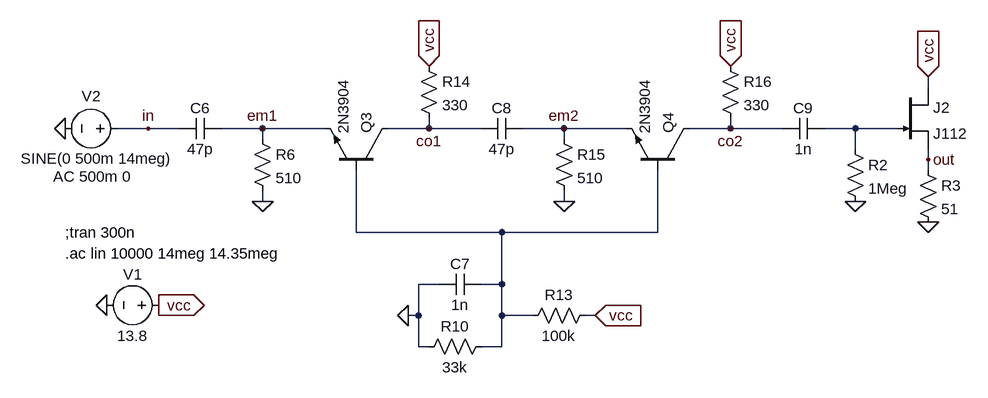
[diagram p0: schematic shifter-simple.asc]
shifter-simple.asc, the LTspice schematic file:
Version 4
SHEET 1 3080 1188
WIRE 2048 736 2048 720
WIRE 848 800 800 800
WIRE 896 800 848 800
WIRE 1024 800 960 800
WIRE 1120 800 1024 800
WIRE 1280 800 1280 784
WIRE 1280 800 1216 800
WIRE 1360 800 1280 800
WIRE 1488 800 1424 800
WIRE 1584 800 1488 800
WIRE 1744 800 1744 784
WIRE 1744 800 1680 800
WIRE 1824 800 1744 800
WIRE 1936 800 1888 800
WIRE 2000 800 1936 800
WIRE 1024 816 1024 800
WIRE 1488 816 1488 800
WIRE 1936 832 1936 800
WIRE 2048 848 2048 832
WIRE 2048 864 2048 848
WIRE 1024 912 1024 896
WIRE 1488 912 1488 896
WIRE 1168 960 1168 864
WIRE 1392 960 1168 960
WIRE 1632 960 1632 864
WIRE 1632 960 1392 960
WIRE 1296 1040 1264 1040
WIRE 1392 1040 1392 960
WIRE 1392 1040 1360 1040
WIRE 1264 1088 1264 1040
WIRE 1264 1088 1248 1088
WIRE 1392 1088 1392 1040
WIRE 1440 1088 1392 1088
WIRE 1536 1088 1520 1088
WIRE 1264 1136 1264 1088
WIRE 1280 1136 1264 1136
WIRE 1392 1136 1392 1088
WIRE 1392 1136 1360 1136
FLAG 864 1072 vcc
IOPIN 864 1072 Out
FLAG 784 1072 0
FLAG 1936 912 0
FLAG 2048 720 vcc
IOPIN 2048 720 In
FLAG 2048 944 0
FLAG 2048 848 out
FLAG 720 800 0
FLAG 848 800 in
FLAG 1024 800 em1
FLAG 1024 912 0
FLAG 1248 1088 0
FLAG 1536 1088 vcc
IOPIN 1536 1088 In
FLAG 1280 704 vcc
IOPIN 1280 704 In
FLAG 1488 800 em2
FLAG 1488 912 0
FLAG 1744 704 vcc
IOPIN 1744 704 In
FLAG 1280 800 co1
FLAG 1744 800 co2
SYMBOL voltage 880 1072 R90
WINDOW 0 -32 56 VBottom 2
WINDOW 3 32 56 VTop 2
WINDOW 123 0 0 Left 0
WINDOW 39 0 0 Left 0
SYMATTR InstName V1
SYMATTR Value 13.8
SYMBOL res 1920 816 R0
SYMATTR InstName R2
SYMATTR Value 1Meg
SYMBOL njf 2000 736 R0
SYMATTR InstName J2
SYMATTR Value J112
SYMBOL res 2032 848 R0
SYMATTR InstName R3
SYMATTR Value 51
SYMBOL voltage 816 800 R90
WINDOW 0 -50 41 VRight 2
WINDOW 3 46 -70 VRight 2
WINDOW 123 74 -7 VRight 2
WINDOW 39 0 0 Left 0
SYMATTR InstName V2
SYMATTR Value SINE(0 500m 14meg)
SYMATTR Value2 AC 500m 0
SYMBOL cap 960 784 R90
WINDOW 0 0 32 VBottom 2
WINDOW 3 32 32 VTop 2
SYMATTR InstName C6
SYMATTR Value 47p
SYMBOL npn 1216 864 M270
SYMATTR InstName Q3
SYMATTR Value 2N3904
SYMBOL res 1008 800 R0
SYMATTR InstName R6
SYMATTR Value 510
SYMBOL res 1376 1120 R90
WINDOW 0 0 56 VBottom 2
WINDOW 3 32 56 VTop 2
SYMATTR InstName R10
SYMATTR Value 33k
SYMBOL cap 1360 1024 R90
WINDOW 0 0 32 VBottom 2
WINDOW 3 32 32 VTop 2
SYMATTR InstName C7
SYMATTR Value 1n
SYMBOL res 1424 1104 R270
WINDOW 0 32 56 VTop 2
WINDOW 3 0 56 VBottom 2
SYMATTR InstName R13
SYMATTR Value 100k
SYMBOL res 1264 688 R0
SYMATTR InstName R14
SYMATTR Value 330
SYMBOL cap 1424 784 R90
WINDOW 0 0 32 VBottom 2
WINDOW 3 32 32 VTop 2
SYMATTR InstName C8
SYMATTR Value 47p
SYMBOL npn 1680 864 M270
SYMATTR InstName Q4
SYMATTR Value 2N3904
SYMBOL res 1472 800 R0
SYMATTR InstName R15
SYMATTR Value 510
SYMBOL res 1728 688 R0
SYMATTR InstName R16
SYMATTR Value 330
SYMBOL cap 1888 784 R90
WINDOW 0 0 32 VBottom 2
WINDOW 3 32 32 VTop 2
SYMATTR InstName C9
SYMATTR Value 1n
TEXT 720 992 Left 2 !.ac lin 10000 14meg 14.35meg
TEXT 720 960 Left 2 !;tran 300n

The netlist it stands for:
* shifter-simple.asc
V1 vcc 0 13.8
R2 N001 0 1Meg
J2 vcc N001 out J112
R3 out 0 51
V2 in 0 SINE(0 500m 14meg) AC 500m 0
C6 em1 in 47p
Q3 co1 N002 em1 0 2N3904
R6 em1 0 510
R10 N002 0 33k
C7 N002 0 1n
R13 N002 vcc 100k
R14 vcc co1 330
C8 em2 co1 47p
Q4 co2 N002 em2 0 2N3904
R15 em2 0 510
R16 vcc co2 330
C9 N001 co2 1n
.model NPN NPN
.model PNP PNP
.lib standard.bjt
.model NJF NJF
.model PJF PJF
.lib standard.jft
.ac lin 10000 14meg 14.35meg
;tran 300n
.backanno
.end